# EAGLE schematic APM2_Adapter (EAGLE 6.1)
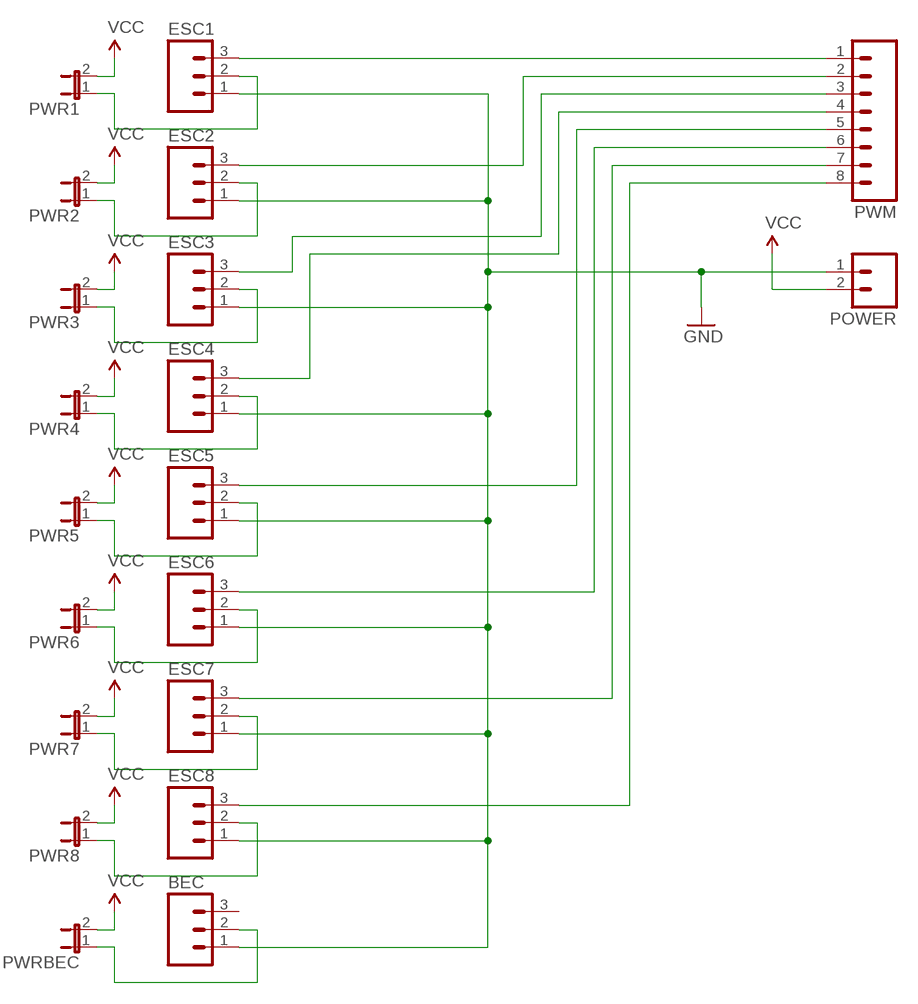
[diagram p0: schematic, sheet 1]

## Parts
BEC  M03LOCK  [1X03_LOCK]
ESC1  M03LOCK  [1X03_LOCK]
ESC2  M03LOCK  [1X03_LOCK]
ESC3  M03LOCK  [1X03_LOCK]
ESC4  M03LOCK  [1X03_LOCK]
ESC5  M03LOCK  [1X03_LOCK]
ESC6  M03LOCK  [1X03_LOCK]
ESC7  M03LOCK  [1X03_LOCK]
ESC8  M03LOCK  [1X03_LOCK]
POWER  M02LOCK  [1X02_LOCK]
PWM  M08LOCK  [1X08_LOCK]
PWR1  JUMPER-2PTH  [1X02]
PWR2  JUMPER-2PTH  [1X02]
PWR3  JUMPER-2PTH  [1X02]
PWR4  JUMPER-2PTH  [1X02]
PWR5  JUMPER-2PTH  [1X02]
PWR6  JUMPER-2PTH  [1X02]
PWR7  JUMPER-2PTH  [1X02]
PWR8  JUMPER-2PTH  [1X02]
PWRBEC  JUMPER-2PTH  [1X02]

## Nets
GND: BEC.1 ESC1.1 ESC2.1 ESC3.1 ESC4.1 ESC5.1 ESC6.1 ESC7.1 ESC8.1 POWER.1
N$2: ESC1.3 PWM.1
N$3: ESC2.3 PWM.2
N$4: ESC3.3 PWM.3
N$5: ESC4.3 PWM.4
N$6: ESC5.3 PWM.5
N$7: ESC6.3 PWM.6
N$8: ESC7.3 PWM.7
N$9: ESC8.3 PWM.8
N$10: ESC2.2 PWR2.1
N$12: ESC1.2 PWR1.1
N$13: ESC3.2 PWR3.1
N$14: ESC4.2 PWR4.1
N$15: ESC5.2 PWR5.1
N$16: ESC6.2 PWR6.1
N$17: ESC7.2 PWR7.1
N$18: ESC8.2 PWR8.1
N$19: BEC.2 PWRBEC.1
VCC: POWER.2 PWR1.2 PWR2.2 PWR3.2 PWR4.2 PWR5.2 PWR6.2 PWR7.2 PWR8.2 PWRBEC.2
Unconnected: BEC.3

## Library data of the parts
BEC ESC1-ESC8 = SparkFun:M03: Header 3 Standard 3-pin 0.1" header. Use with straight break away headers (SKU : PRT-00116), right angle break away headers (PRT-00553), swiss pins (PRT-00743), machine pins (PRT-00117), and female headers (PRT-00115). Molex polarized connector foot print use with SKU : PRT-08232 with associated crimp pins and housings.
POWER = SparkFun:M02: Header 2 Standard 2-pin 0.1" header. Use with straight break away headers (SKU : PRT-00116), right angle break away headers (PRT-00553), swiss pins (PRT-00743), machine pins (PRT-00117), and female headers (PRT-00115). Molex polarized connector foot print use with SKU : PRT-08233 with associated crimp pins and housings.
PWM = SparkFun:M08: Header 8 Standard 8-pin 0.1" header. Use with straight break away headers (SKU : PRT-00116), right angle break away headers (PRT-00553), swiss pins (PRT-00743), machine pins (PRT-00117), and female headers (PRT-00115).
PWR1-PWR8 PWRBEC = SparkFun:JUMPER-2: Jumper Basic 0.1" spaced jumper. Use with breakaway headers.